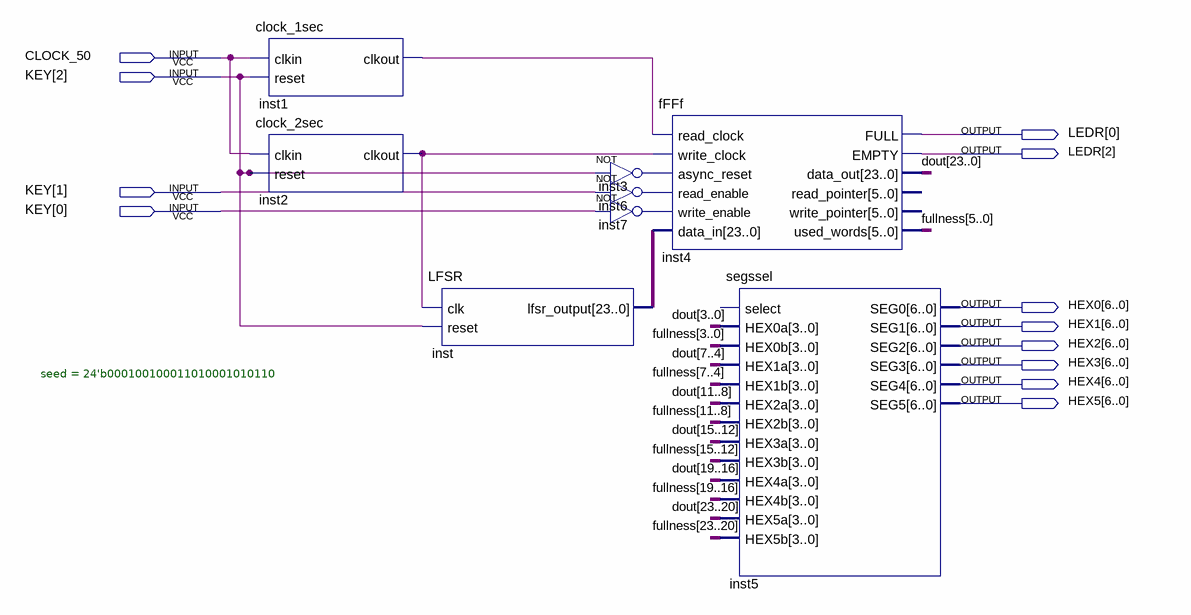
[diagram p0: schematic sheet]
// Quartus schematic top_lab3.bdf as structural Verilog: 8 symbols, 12 pins
module top_lab3 (
  input  CLOCK_50,
  input  [2:0] KEY,
  output [2:0] LEDR,
  output [6:0] HEX0,
  output [6:0] HEX1,
  output [6:0] HEX2,
  output [6:0] HEX3,
  output [6:0] HEX4,
  output [6:0] HEX5
);

  wire inst1_clkout, inst2_clkout, inst3_out, inst6_out, inst7_out;
  wire [23:0] dout, fullness, inst_lfsr_output;

  clock_1sec inst1 (.clkin(CLOCK_50), .reset(KEY[2]), .clkout(inst1_clkout));
  clock_2sec inst2 (.clkin(CLOCK_50), .reset(KEY[2]), .clkout(inst2_clkout));
  LFSR #(.seed(24'b000100100011010001010110)) inst (.clk(inst2_clkout), .reset(KEY[2]), .lfsr_output(inst_lfsr_output));
  not inst3 (inst3_out, KEY[2]);
  not inst6 (inst6_out, KEY[1]);
  not inst7 (inst7_out, KEY[0]);
  fFFf inst4 (
    .read_clock(inst1_clkout), .write_clock(inst2_clkout), .async_reset(inst3_out), .read_enable(inst6_out),
    .write_enable(inst7_out), .data_in(inst_lfsr_output), .FULL(LEDR[0]), .EMPTY(LEDR[2]), .data_out(dout),
    .used_words(fullness[5:0]));  // open: read_pointer, write_pointer
  segssel inst5 (
    .HEX0a(dout[3:0]), .HEX0b(fullness[3:0]), .HEX1a(dout[7:4]), .HEX1b(fullness[7:4]), .HEX2a(dout[11:8]),
    .HEX2b(fullness[11:8]), .HEX3a(dout[15:12]), .HEX3b(fullness[15:12]), .HEX4a(dout[19:16]),
    .HEX4b(fullness[19:16]), .HEX5a(dout[23:20]), .HEX5b(fullness[23:20]), .SEG0(HEX0), .SEG1(HEX1),
    .SEG2(HEX2), .SEG3(HEX3), .SEG4(HEX4), .SEG5(HEX5));  // open: select
endmodule
